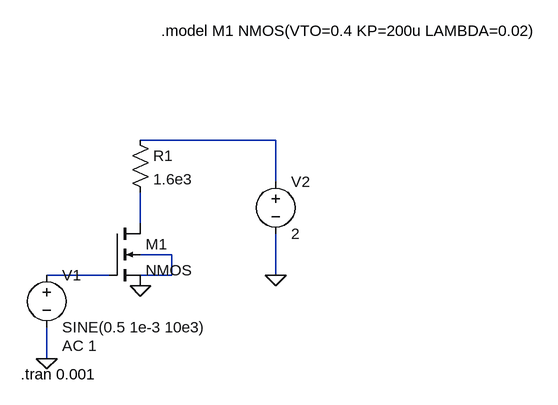
[diagram p0: schematic nmos.asc]
nmos.asc, the LTspice schematic file:
Version 4.1
SHEET 1 1128 680
WIRE 432 -64 224 -64
WIRE 432 0 432 -64
WIRE 224 64 224 16
WIRE 272 112 224 112
WIRE 176 144 80 144
WIRE 272 144 272 112
WIRE 272 144 224 144
WIRE 432 144 432 80
WIRE 80 272 80 224
FLAG 224 160 0
FLAG 80 272 0
FLAG 432 144 0
DATAFLAG 240 -64 "I(R1)"
SYMBOL nmos4 176 64 R0
SYMATTR InstName M1
SYMATTR Value2 l=1u w=300u
SYMBOL res 208 -80 R0
SYMATTR InstName R1
SYMATTR Value 1.6e3
SYMBOL voltage 80 128 R0
WINDOW 123 24 124 Left 2
WINDOW 39 0 0 Left 0
SYMATTR Value2 AC 1
SYMATTR InstName V1
SYMATTR Value SINE(0.5 1e-3 10e3)
SYMBOL voltage 432 -16 R0
WINDOW 123 0 0 Left 0
WINDOW 39 0 0 Left 0
SYMATTR InstName V2
SYMATTR Value 2
TEXT 256 -232 Left 2 !.model M1 NMOS(VTO=0.4 KP=200u LAMBDA=0.02)
TEXT 40 296 Left 2 !.tran 0.001

The netlist it stands for:
* nmos.asc
M1 N002 N004 0 N003 NMOS l=1u w=300u
R1 N001 N002 1.6e3
V1 N004 0 SINE(0.5 1e-3 10e3) AC 1
V2 N001 0 2
.model NMOS NMOS
.model PMOS PMOS
.lib standard.mos
.model M1 NMOS(VTO=0.4 KP=200u LAMBDA=0.02)
.tran 0.001
.backanno
.end